# EAGLE design Stereo RDS Encoder-Digital Board (EAGLE 9.6.2)
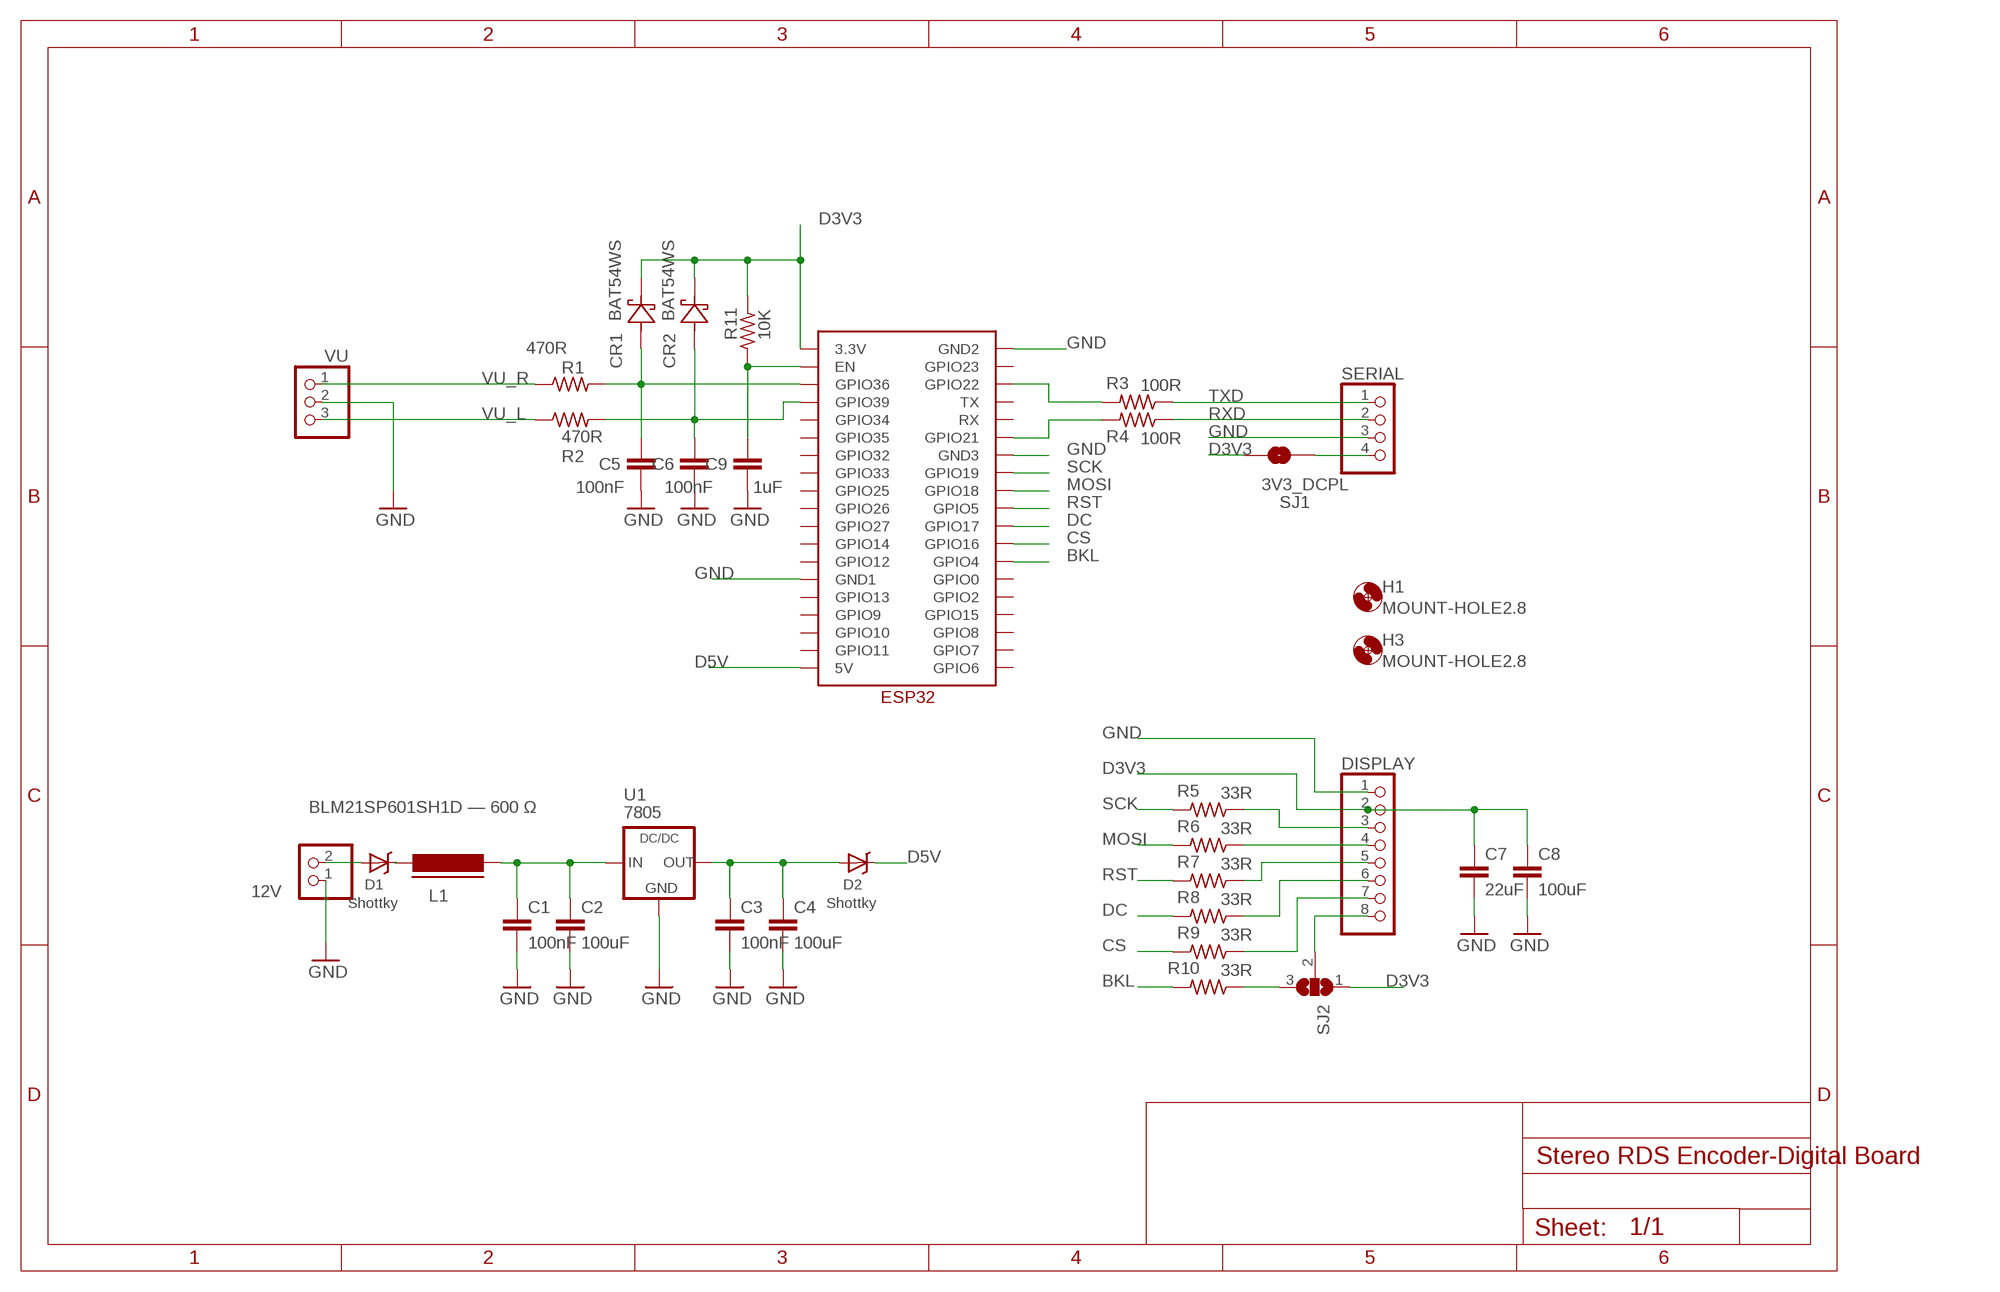
[diagram p0: schematic, sheet 1]

## Parts
12V  PINHD-1X2  [1X02]
C1  100nF  C-EUC0805  [C0805]
C2  100uF  C-EUC0805  [C0805]
C3  100nF  C-EUC0805  [C0805]
C4  100uF  C-EUC0805  [C0805]
C5  100nF  C-EUC0805  [C0805]
C6  100nF  C-EUC0805  [C0805]
C7  22uF  C-EUC0805  [C0805]
C8  100uF  C-EUC0805  [C0805]
C9  1uF  C-EUC0805  [C0805]
CR1  BAT54WS  BAT54WS-E3-18  [SDO_SOD-323_VIS]
CR2  BAT54WS  BAT54WS-E3-18  [SDO_SOD-323_VIS]
D1  Shottky  DIODE-SCHOTTKYSMA-403D  [SMA-403D]
D2  Shottky  DIODE-SCHOTTKYSMA-403D  [SMA-403D]
DEV1  ESP32  [ESP32]
DISPLAY  PINHD-1X8  [1X08]
H1  MOUNT-HOLE2.8  [2,8]
H3  MOUNT-HOLE2.8  [2,8]
L1  BLM21SP601SH1D — 600 Ω  FERRITE-0805  [FB805]
R1  470R  R-US_M0805  [M0805]
R2  470R  R-US_M0805  [M0805]
R3  100R  R-US_M0805  [M0805]
R4  100R  R-US_M0805  [M0805]
R5  33R  R-US_M0805  [M0805]
R6  33R  R-US_M0805  [M0805]
R7  33R  R-US_M0805  [M0805]
R8  33R  R-US_M0805  [M0805]
R9  33R  R-US_M0805  [M0805]
R10  33R  R-US_M0805  [M0805]
R11  10K  R-US_M0805  [M0805]
SERIAL  PINHD-1X4  [1X04]
SJ1  3V3_DCPL  SOLDERJUMPERNO  [SJ_2S-NO]
SJ2  SJ2W  [SJ_2]
U1  7805  R-78XX  [R-78XX]
VU  PINHD-1X3  [1X03]

## Nets
BKL: DEV1.GPIO4 R10.2
CS: DEV1.GPIO16 R9.2
D3V3: C7.1 C8.1 CR1.1(CATHODE) CR2.1(CATHODE) DEV1.3.3V DISPLAY.2 R11.2 SJ1.1 SJ2.1
D5V: D2.C DEV1.5V
D5V1: C1.1 C2.1 L1.2 U1.1(IN)
DC: DEV1.GPIO17 R8.2
GND: 12V.1 C1.2 C2.2 C3.2 C4.2 C5.2 C6.2 C7.2 C8.2 C9.2 DEV1.GND1 DEV1.GND2 DEV1.GND3 DISPLAY.1 SERIAL.3 U1.2(GND) VU.2
MOSI: DEV1.GPIO18 R6.2
N$1: R10.1 SJ2.3
N$2: DEV1.GPIO21 R4.2
N$3: DEV1.GPIO22 R3.2
N$4: SERIAL.4 SJ1.2
N$5: C9.1 DEV1.EN R11.1
N$7: D1.C L1.1
N$8: 12V.2 D1.A
N$9: C5.1 CR1.2(ANODE) DEV1.GPIO36 R1.2
N$10: C6.1 CR2.2(ANODE) DEV1.GPIO39 R2.2
N$55: DISPLAY.3 R5.1
N$66: DISPLAY.4 R6.1
N$77: DISPLAY.5 R7.1
N$88: DISPLAY.6 R8.1
N$99: DISPLAY.7 R9.1
N$111\: DISPLAY.8 SJ2.2
N$222: C3.1 C4.1 D2.A U1.3(OUT)
RST: DEV1.GPIO5 R7.2
RXD: R4.1 SERIAL.2
SCK: DEV1.GPIO19 R5.2
TXD: R3.1 SERIAL.1
VU_L: R2.1 VU.3
VU_R: R1.1 VU.1
Unconnected: DEV1.GPIO0 DEV1.GPIO2 DEV1.GPIO6 DEV1.GPIO7 DEV1.GPIO8 DEV1.GPIO9 DEV1.GPIO10 DEV1.GPIO11 DEV1.GPIO12 DEV1.GPIO13 DEV1.GPIO14 DEV1.GPIO15 DEV1.GPIO23 DEV1.GPIO25 DEV1.GPIO26 DEV1.GPIO27 DEV1.GPIO32 DEV1.GPIO33 DEV1.GPIO34 DEV1.GPIO35 DEV1.RX DEV1.TX

## Library data of the parts
12V = pinhead:PINHD-1X2: PIN HEADER
C1-C9 = rcl:C-EU: CAPACITOR, European symbol; SPICEPREFIX: C
CR1 CR2 = BAT54WS:BAT54WS-E3-18; COPYRIGHT: Copyright (C) 2025 Ultra Librarian. All rights reserved.; DATASHEET: https://www.vishay.com/doc?85667; DESCRIPTION: SCHOTTKY DIODE SOD323; MANUFACTURER_NAME: Vishay; MANUFACTURER_PART_NUMBER: BAT54WS-E3-18
D1 D2 = Ai_DiscreteSemis:DIODE-SCHOTTKY: Commonly MBRA140.
DEV1 = ESP32:ESP32
DISPLAY = pinhead:PINHD-1X8: PIN HEADER
H1 H3 = holes:MOUNT-HOLE: MOUNTING HOLE with drill center marker
L1 = Dangerous Prototypes_devices:FERRITE: Ferrite bead in various packages
R1-R11 = adafruit:R-US_: RESISTOR, American symbol
SERIAL = pinhead:PINHD-1X4: PIN HEADER
SJ1 = SparkFun-Passives:SOLDERJUMPER: Solder Jumper Standard SMD solder jumper. Used to automate production. Two varients : Normally Open and Normally Closed are the same, but have different paste layers. NC will have a large amount of paste and should jumper during reflow.
SJ2 = jumper:SJ2W: SMD solder JUMPER
U1 = recom-intl:R-78XX: DC-DC CONVERTER R-78xx-0.5 Series
VU = pinhead:PINHD-1X3: PIN HEADER

## Board
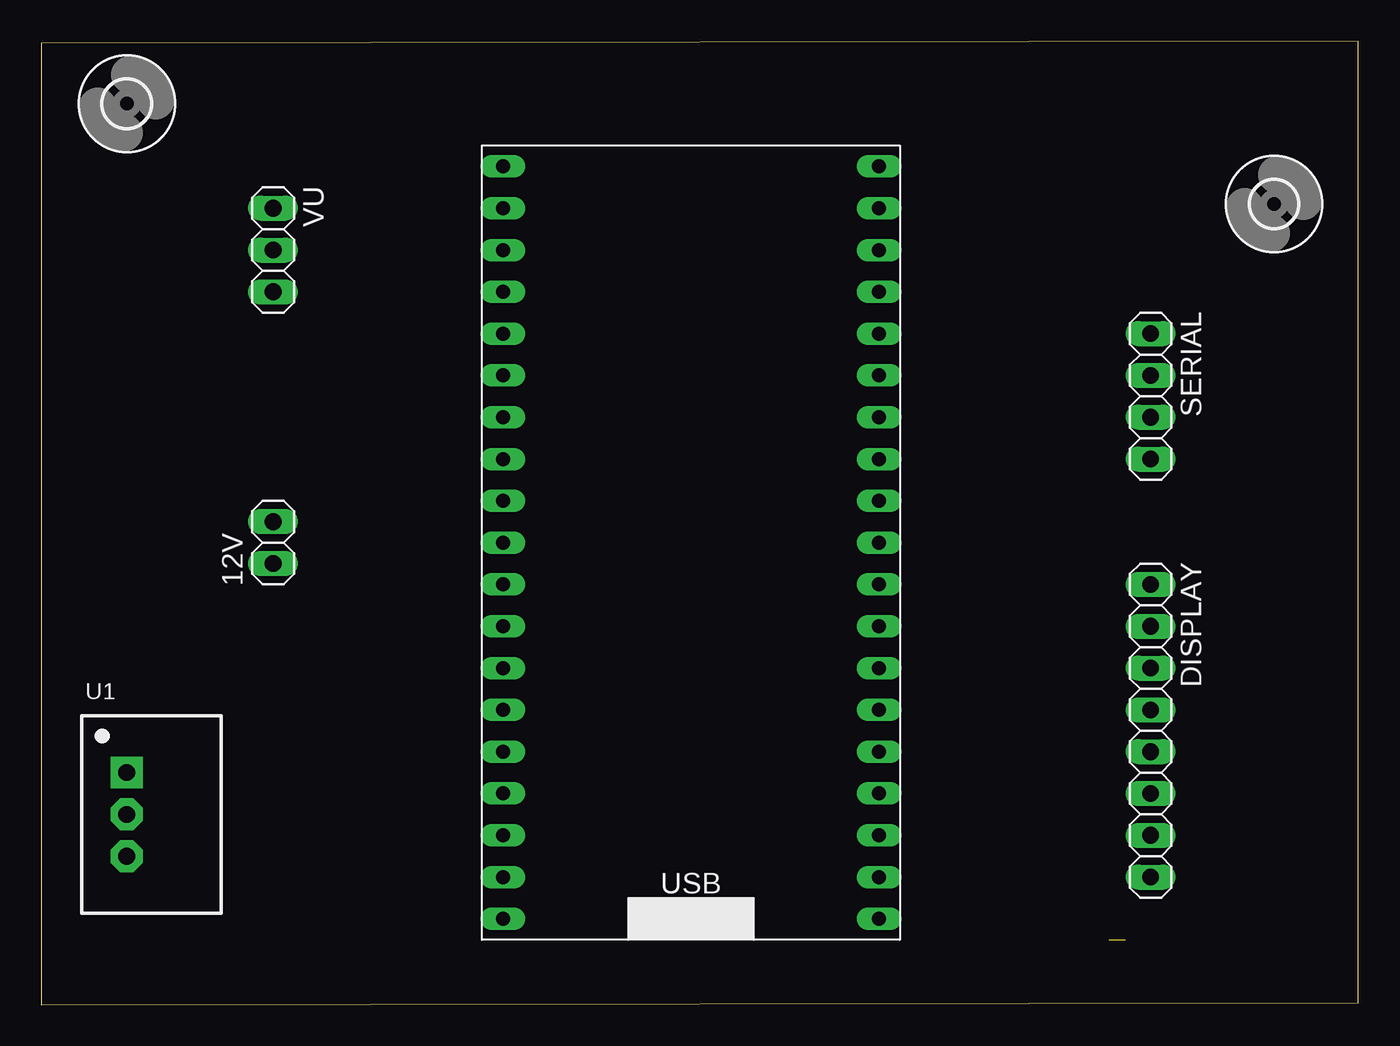
[diagram p1: board, top side]
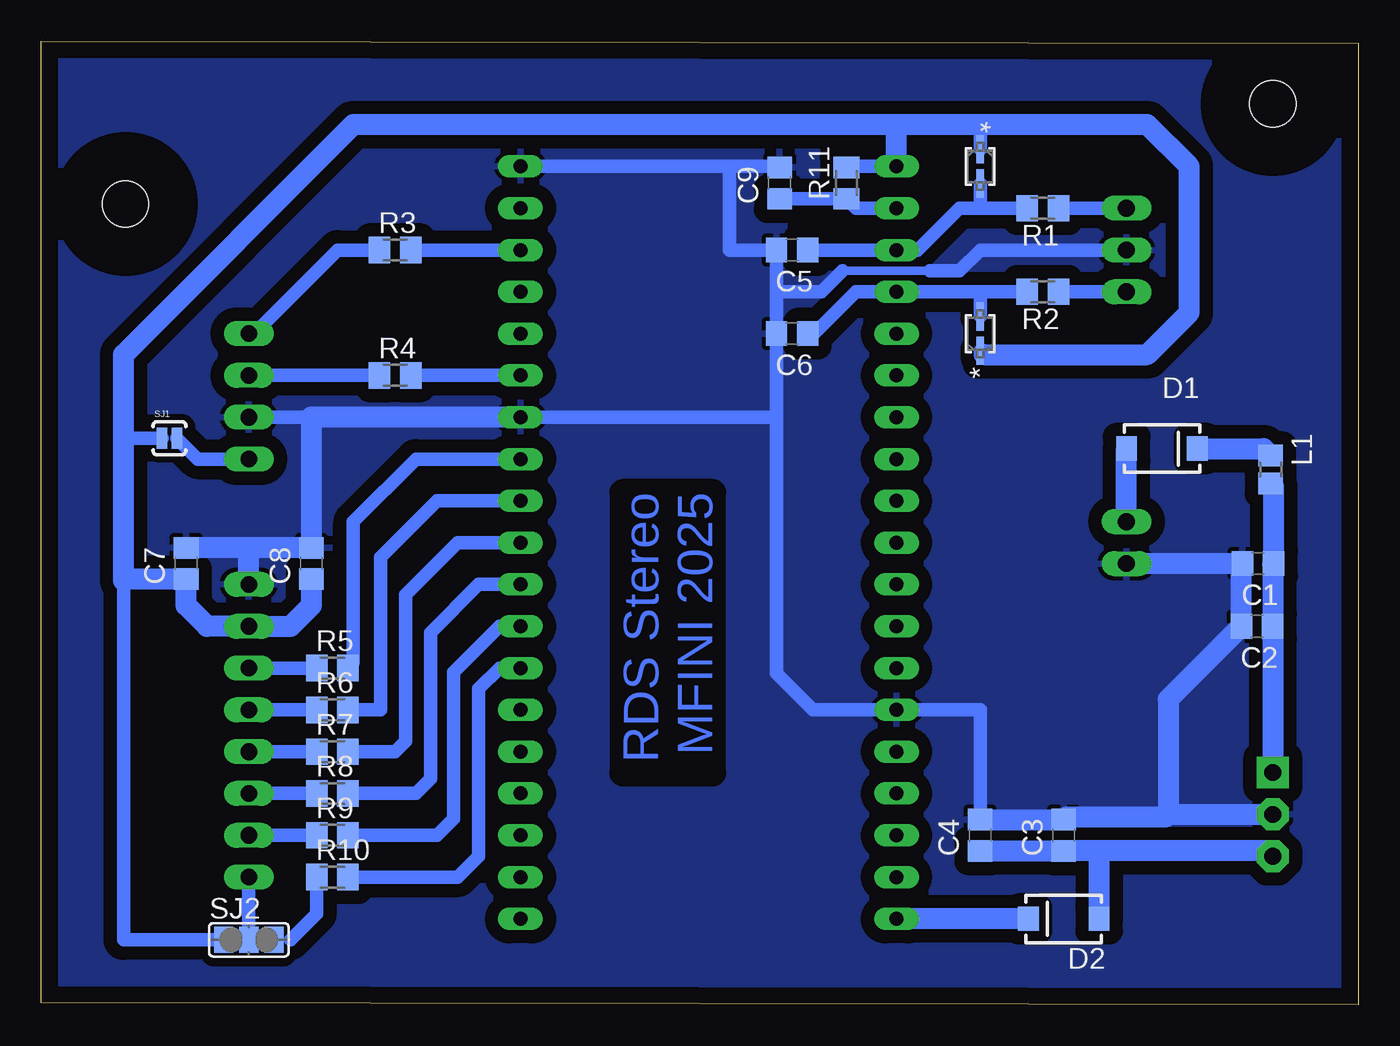
[diagram p2: board, bottom side, seen from below]

Size 80.06 x 58.54 mm. Coordinates in mm from the lower left corner, seen from the top.
Outline: 0,0 80.06,0.13 80.06,58.54 0,58.41 0,0
Copper layers (1*16): Top 0.035mm / dielectric 1.5mm / Bottom 0.035mm
Design rules "default": minimum track width 6mil, minimum drill 0.35mm, track to track 6mil, track to pad 6mil, pad to pad 6mil, via to via 6mil, smd to smd 6mil, copper to edge 40mil, drill to drill 6mil, minimum pad ring 10mil, minimum via ring 8mil, stop-mask expansion 4mil, vias tented up to drill 0mil, thermal gap 10mil

### Footprints (pad centres in the part's own frame; a part is rotated, then mirrored left to right if it is on the bottom)
1X02 = drill 1.016 long: 1 -1.27,0; 2 1.27,0
C0805 = smd 1.3 x 1.5: 1 -0.95,0; 2 0.95,0
SDO_SOD-323_VIS = smd 1.727 x 0.457: 1 -1.041,0; 2 1.041,0
SMA-403D = smd 1.27 x 1.47: A -2.15,0; C 2.15,0
ESP32 = drill 0.85 long: 3.3V 1.27,46.99; 5V 1.27,1.27; EN 1.27,44.45; GND1 1.27,13.97; GND2 24.13,46.99; GND3 24.13,31.75; GPIO0 24.13,13.97; GPIO2 24.13,11.43; GPIO4 24.13,16.51; GPIO5 24.13,24.13; GPIO6 24.13,1.27; GPIO7 24.13,3.81; GPIO8 24.13,6.35; GPIO9 1.27,8.89; GPIO10 1.27,6.35; GPIO11 1.27,3.81; GPIO12 1.27,16.51; GPIO13 1.27,11.43; GPIO14 1.27,19.05; GPIO15 24.13,8.89; GPIO16 24.13,19.05; GPIO17 24.13,21.59; GPIO18 24.13,26.67; GPIO19 24.13,29.21; GPIO21 24.13,34.29; GPIO22 24.13,41.91; GPIO23 24.13,44.45; GPIO25 1.27,26.67; GPIO26 1.27,24.13; GPIO27 1.27,21.59; GPIO32 1.27,31.75; GPIO33 1.27,29.21; GPIO34 1.27,36.83; GPIO35 1.27,34.29; GPIO36 1.27,41.91; GPIO39 1.27,39.37; RX 24.13,36.83; TX 24.13,39.37
1X08 = drill 1.016 long: 1 -8.89,0; 2 -6.35,0; 3 -3.81,0; 4 -1.27,0; 5 1.27,0; 6 3.81,0; 7 6.35,0; 8 8.89,0
2,8 = hole 2.8: 0,0
FB805 = smd 1.3 x 1.5: 1 -0.85,0; 2 0.85,0
M0805 = smd 1.3 x 1.6: 1 -0.95,0; 2 0.95,0
1X04 = drill 1.016 long: 1 -3.81,0; 2 -1.27,0; 3 1.27,0; 4 3.81,0
SJ_2S-NO = smd 0.635 x 1.27: 1 -0.45,0; 2 0.45,0
SJ_2 = smd 1.168 x 1.6: 1 -1.524,0; 2 0,0; 3 1.524,0
R-78XX = drill 1.016 pad 1.93 square: 1 -2.54,0 | drill 1.016 pad 1.93 octagon: 2 0,0; 3 2.54,0
1X03 = drill 1.016 long: 1 -2.54,0; 2 0,0; 3 2.54,0

### Placement (x,y rotation side)
12V  14.1,28.07 90 top
C1  6.1,26.8 180 bottom
C2  6.16,22.99 180 bottom
C3  17.91,10.29 90 bottom
C4  22.99,10.29 90 bottom
C5  34.42,45.85 180 bottom
C6  34.42,40.77 180 bottom
C7  71.25,26.8 90 bottom
C8  63.63,26.8 90 bottom
C9  35.18,49.91 90 bottom
CR1  22.99,50.93 270 bottom
CR2  22.99,40.77 90 bottom
D1  11.94,33.78 0 bottom
D2  17.91,5.21 180 bottom
DEV1  26.8,3.94 0 top
DISPLAY  67.44,16.64 270 top
H1  5.21,54.74 0 top
H3  74.93,48.64 0 top
L1  5.33,32.51 270 bottom
R1  19.18,48.39 180 bottom
R2  19.18,43.31 180 bottom
R3  58.55,45.85 0 bottom
R4  58.55,38.23 0 bottom
R5  62.36,20.45 0 bottom
R6  62.36,17.91 0 bottom
R7  62.36,15.37 0 bottom
R8  62.36,12.83 0 bottom
R9  62.36,10.29 0 bottom
R10  62.36,7.75 0 bottom
R11  31.11,49.91 90 bottom
SERIAL  67.44,36.96 270 top
SJ1  72.26,34.42 0 bottom
SJ2  67.44,3.94 0 bottom
U1  5.21,11.56 270 top
VU  14.1,45.85 270 top

### Tracks (layer width: path | path; a pad name or v marks a point on that pad's centre or on a via)
BKL
  Bottom 0.813: R10.2 54.74,7.75 53.47,9.02 53.47,19.18 52.2,20.45 DEV1.GPIO4
CS
  Bottom 0.813: DEV1.GPIO16 52.2,22.99 54.99,20.19 54.99,11.3 56.01,10.29 R9.2
D3V3
  Bottom 0.813: SJ2.1 75.06,3.94 75.06,25.78 74.99,25.85 | SJ1.1 75.06,34.42 | CR2.1 22.76,39.5 | CR1.1 22.99,53.47 | DEV1.3.3V 31.05,50.93 R11.2
  Bottom 1.27: 28.07,53.47 61.09,53.47 75.06,39.5 75.06,34.42 75.06,25.78 | C8.1 63.63,24.26 64.9,22.99 DISPLAY.2 69.98,22.99 71.25,24.26 C7.1 74.99,25.85 | 22.76,39.5 12.83,39.5 10.29,42.04 10.29,50.93 12.83,53.47 22.99,53.47 28.07,53.47 | DEV1.3.3V 28.07,53.47
D5V
  Bottom 1.27: D2.C DEV1.5V
D5V1
  Bottom 0.813: C1.1 5.21,26.74 | 5.15,31.47 L1.2
  Bottom 1.27: 5.21,26.74 C2.1 U1.1 | C1.1 5.15,31.47
DC
  Bottom 0.813: DEV1.GPIO17 53.47,25.53 56.39,22.61 56.39,13.72 57.28,12.83 R8.2
GND
  Bottom 0.508: 25.53,44.58 31.37,44.58
  Bottom 0.813: 35.37,43.31 C6.2 35.37,35.69 | DEV1.GND3 35.37,35.69 | 63.63,35.69 SERIAL.3 | 17.59,11.56 17.75,11.4 C3.2 | C4.2 22.99,17.91 DEV1.GND1 33.15,17.91 35.37,20.13 35.37,35.69 | 7.11,26.74 C1.2 | VU.2 22.99,45.85 24.26,44.58 25.53,44.58 26.04,44.58 | 31.37,44.58 32.64,43.31 35.37,43.31 | 35.37,43.31 C5.2 38.23,45.85 38.23,50.93 | C9.2 35.25,50.93 38.23,50.93 | 38.23,50.93 DEV1.GND2
  Bottom 1.27: DEV1.GND3 63.63,35.69 C8.2 67.44,27.75 | C4.2 C3.2 | 11.56,11.56 11.56,18.54 C2.2 7.11,26.74 | 67.44,27.75 C7.2 | DISPLAY.1 67.44,27.75 | C1.2 12V.1 | 11.56,11.56 U1.2 | 11.56,11.56 11.72,11.4 17.75,11.4
  pour Bottom (isolate 0.813): 0.13,0.13 0.13,58.55 80.14,58.55 80.14,0.13
MOSI
  Bottom 0.813: R6.2 59.44,17.91 59.44,27.18 56.01,30.61 DEV1.GPIO18
N$1  (1 unrouted)
  Bottom 0.813: R10.1 63.31,5.53 64.9,3.94
N$2
  Bottom 0.813: R4.2 DEV1.GPIO21
N$3
  Bottom 0.813: R3.2 DEV1.GPIO22
N$4
  Bottom 0.813: SJ1.2 70.54,33.15 SERIAL.4
N$5
  Bottom 0.813: DEV1.EN 30.54,48.39 R11.1 C9.1
N$7
  Bottom 1.27: D1.C 5.75,33.78 L1.1
N$8
  Bottom 0.813: 12V.2
  Bottom 1.27: 12V.2 D1.A
N$9
  Bottom 0.813: C5.1 DEV1.GPIO36 26.8,45.85 24.26,48.39 22.99,48.39 | 22.99,48.39 R1.2 | CR1.2 22.99,48.39
N$10
  Bottom 0.813: C6.1 33.09,40.77 30.55,43.31 DEV1.GPIO39 22.99,43.31 | 22.99,43.31 R2.2 | CR2.2 22.99,43.31
N$55
  Bottom 0.813: R5.1 DISPLAY.3
N$66
  Bottom 0.813: DISPLAY.4 R6.1
N$77
  Bottom 0.813: R7.1 DISPLAY.5
N$88
  Bottom 0.813: DISPLAY.6 R8.1
N$99
  Bottom 0.813: R9.1 DISPLAY.7
N$111\
  Bottom 0.813: DISPLAY.8 SJ2.2
N$222
  Bottom 1.27: C4.1 C3.1 15.75,9.34 | U1.3 5.53,9.34 15.75,9.34 | D2.A 15.76,9.33 15.75,9.34
RST
  Bottom 0.813: DEV1.GPIO5 54.74,28.07 57.91,24.89 57.91,16 58.55,15.37 R7.2
RXD
  Bottom 0.813: SERIAL.2 R4.1
SCK
  Bottom 0.813: DEV1.GPIO19 57.28,33.15 61.09,29.34 61.09,20.77 R5.2
TXD
  Bottom 0.813: SERIAL.1 67.12,40.77 62.04,45.85 R3.1
VU_L
  Bottom 0.813: R2.1 VU.3
VU_R
  Bottom 0.813: VU.1 R1.1

### Text on the board
Bottom: RDS Stereo / MFINI 2025
Document: Display on bottom / Analog board this side